# Altium schematic sheet Control_Sense_BOTT.SchDoc (part 1 of 5)
size A0 portrait; SheetNumber: 1; SheetTotal: 4
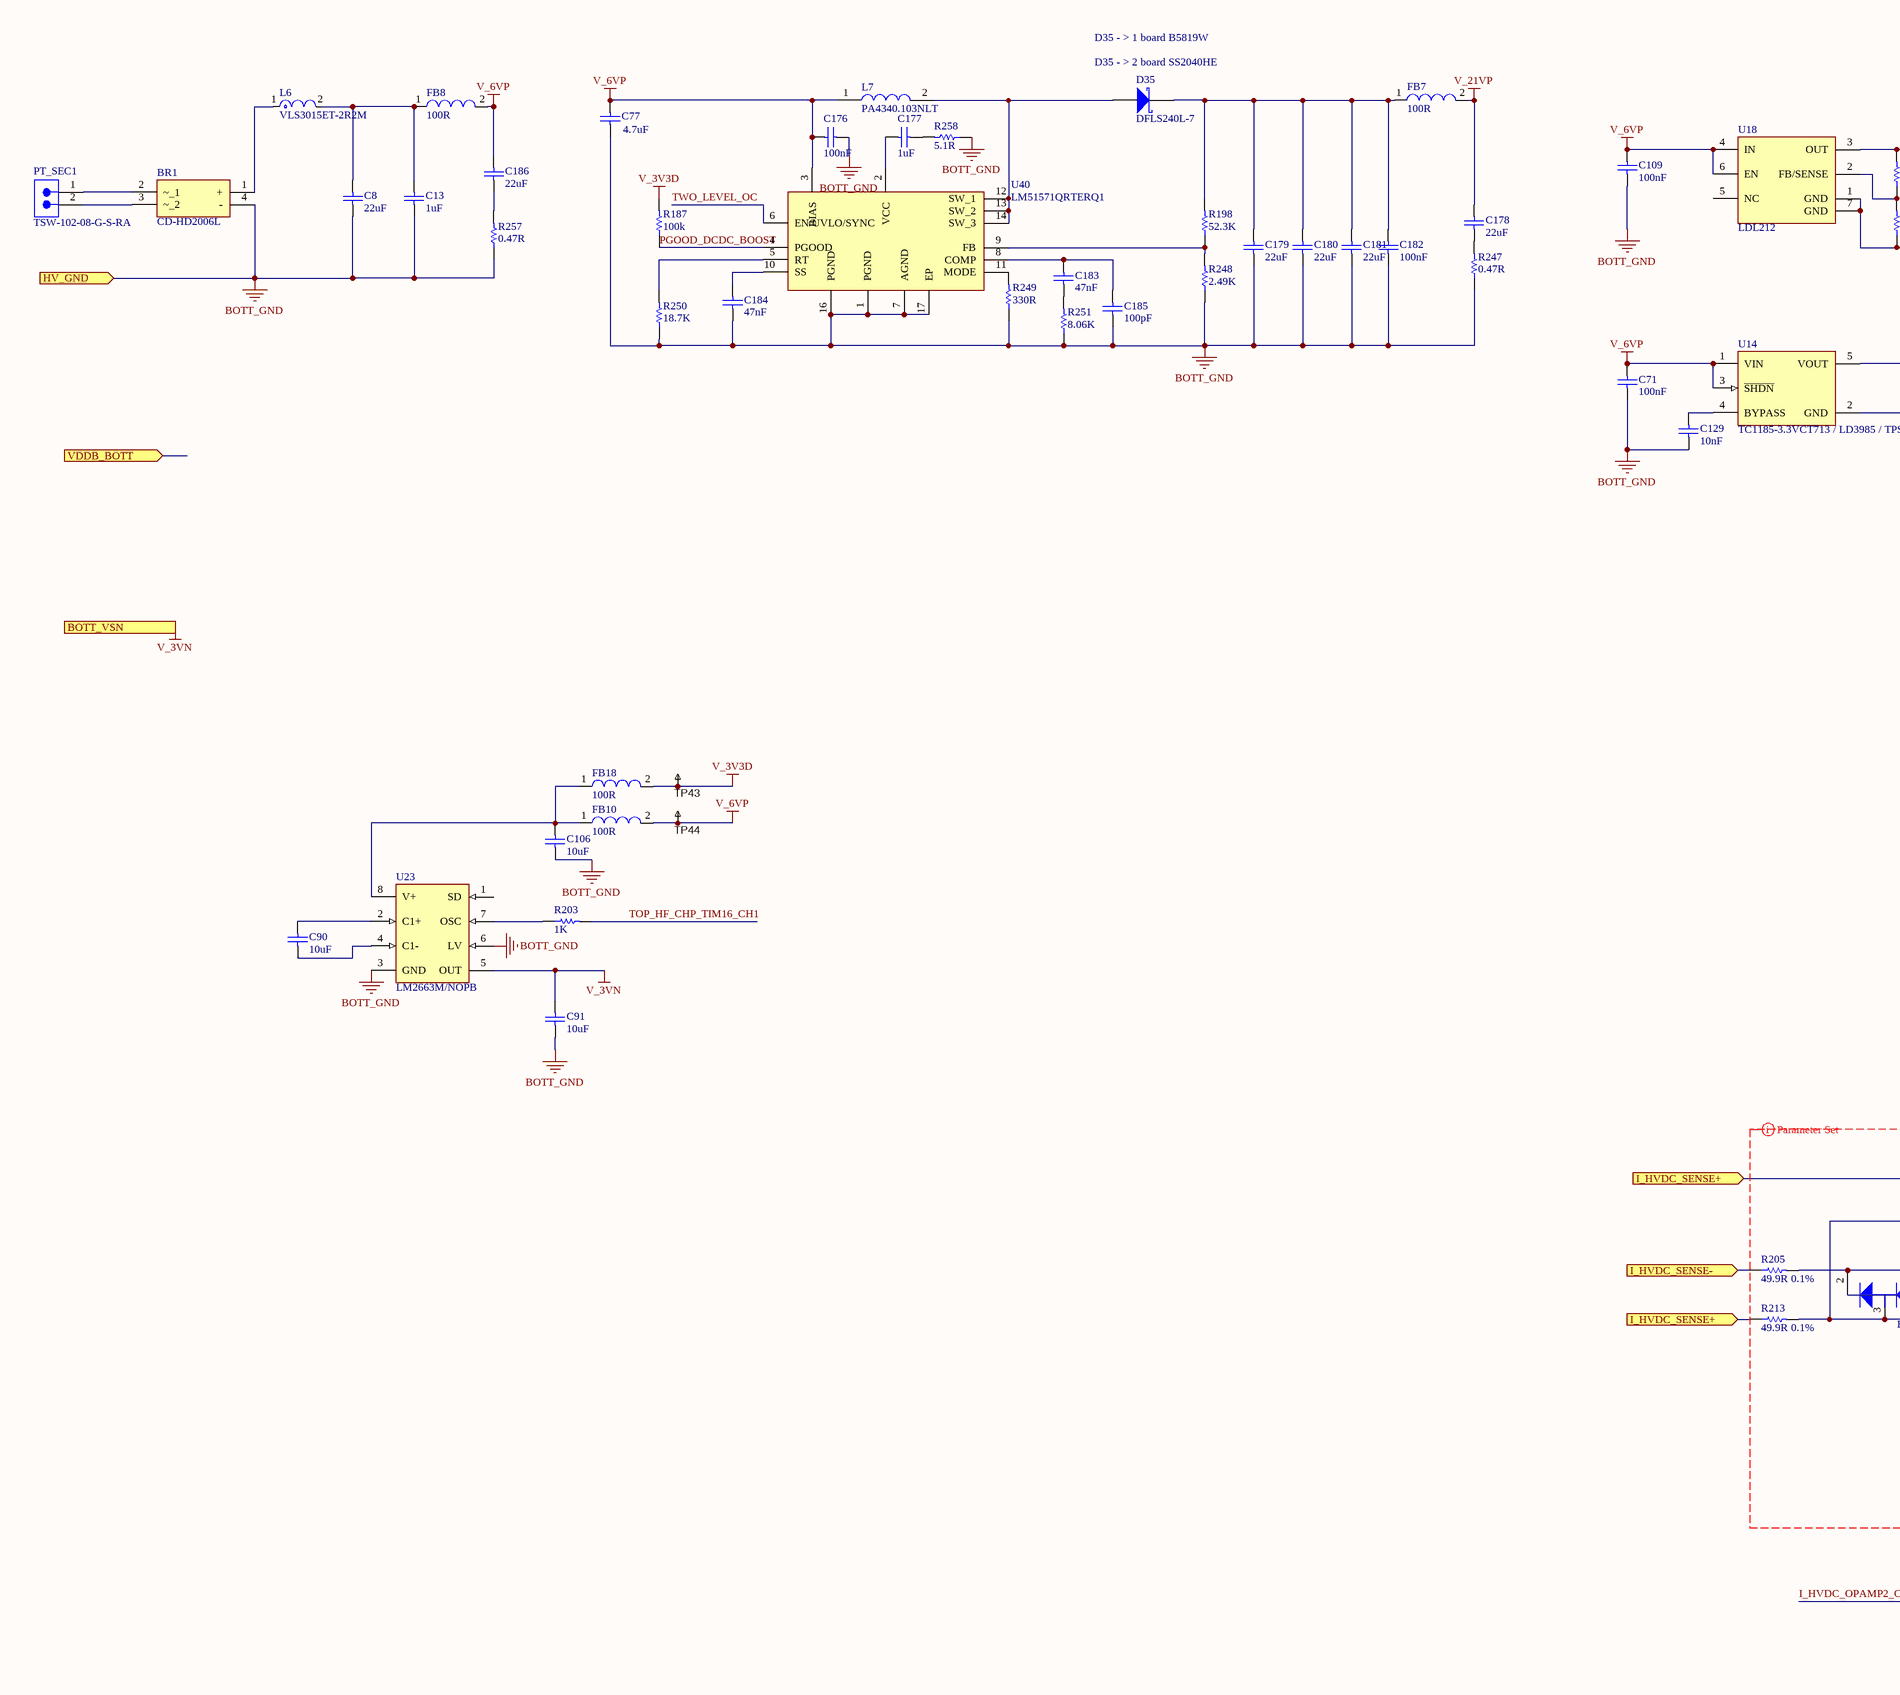
[diagram p0: Control_Sense_BOTT.SchDoc, top left]
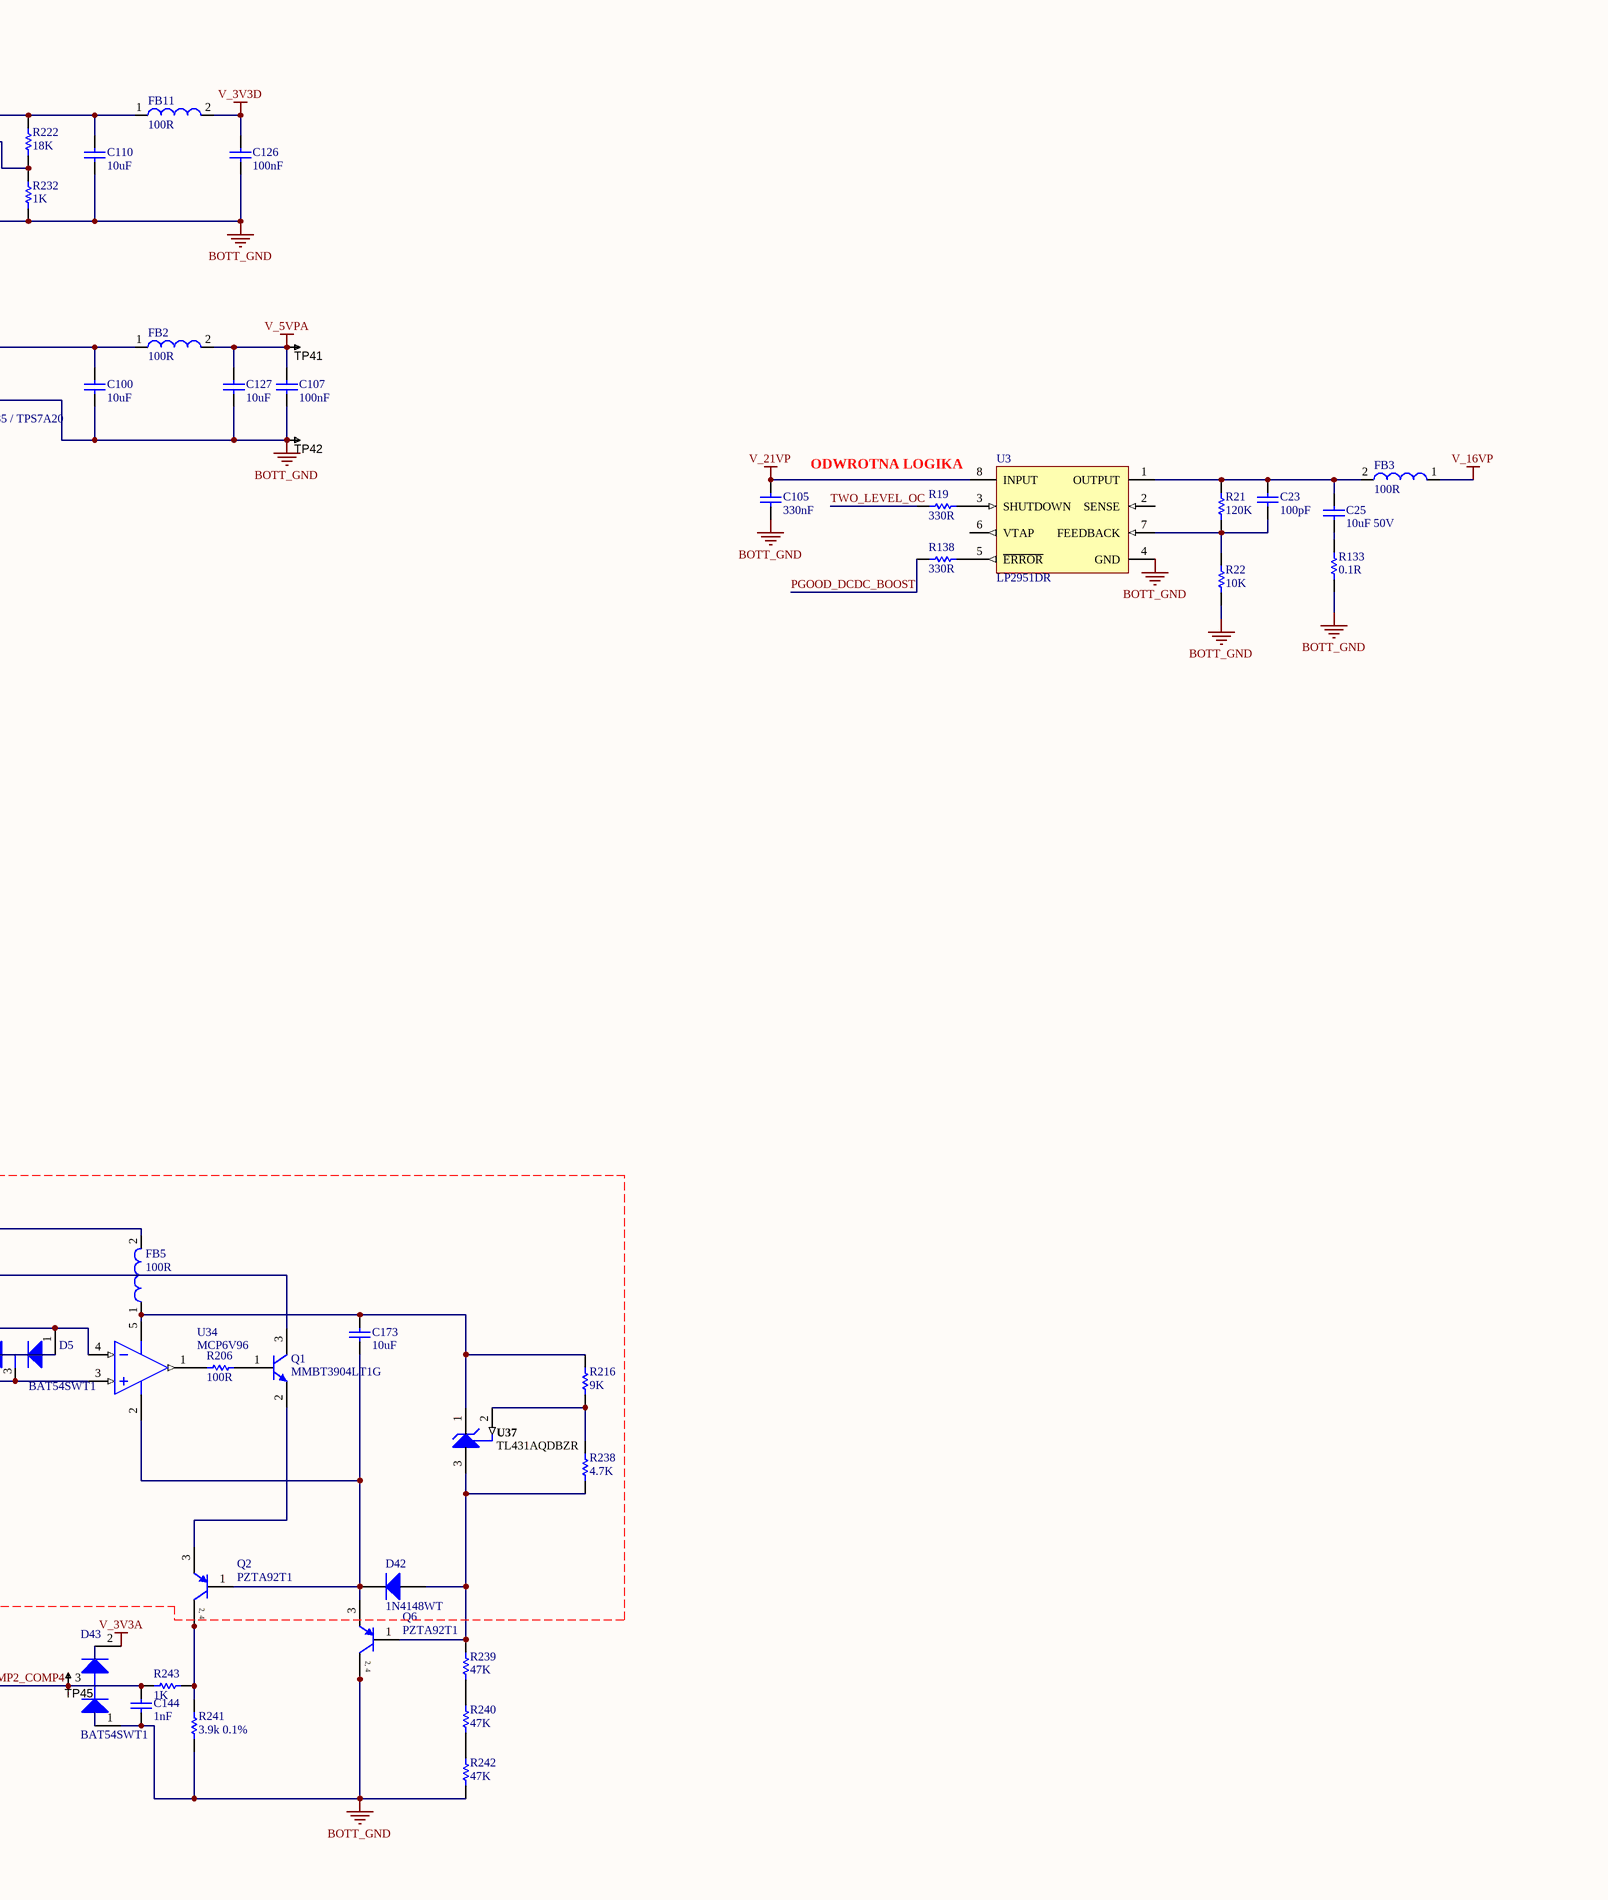
[diagram p1: Control_Sense_BOTT.SchDoc, top right]
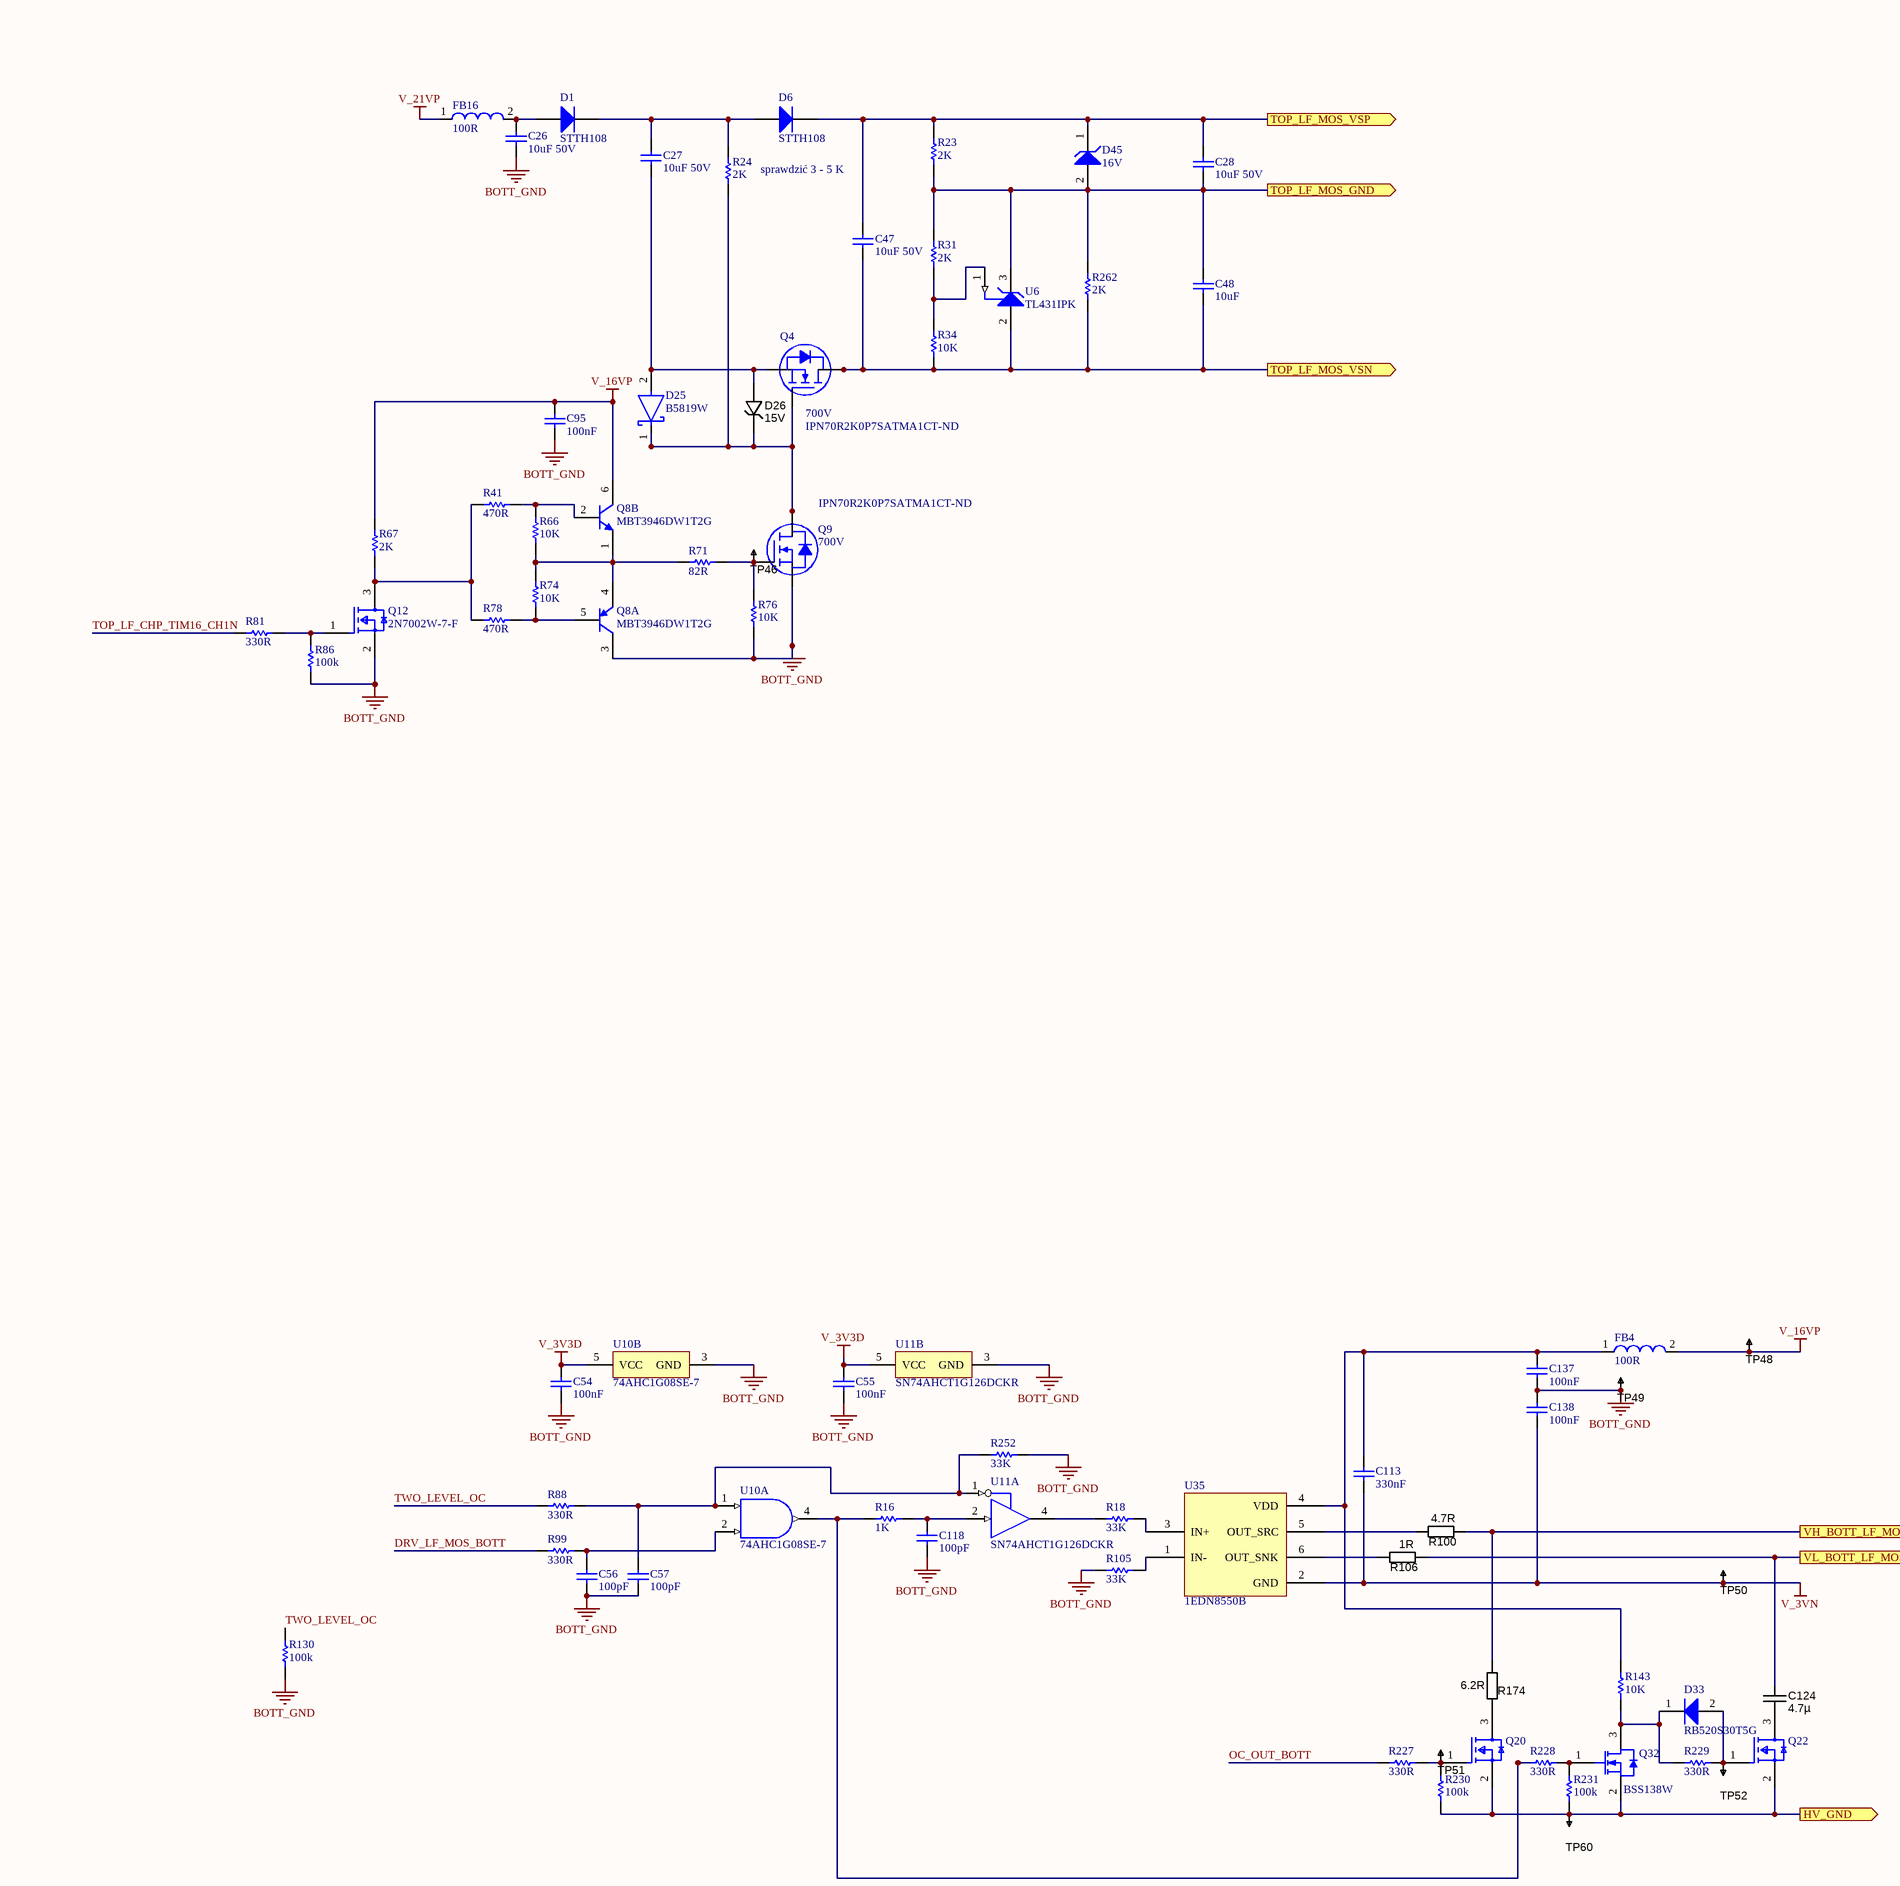
[diagram p2: Control_Sense_BOTT.SchDoc, centre left]
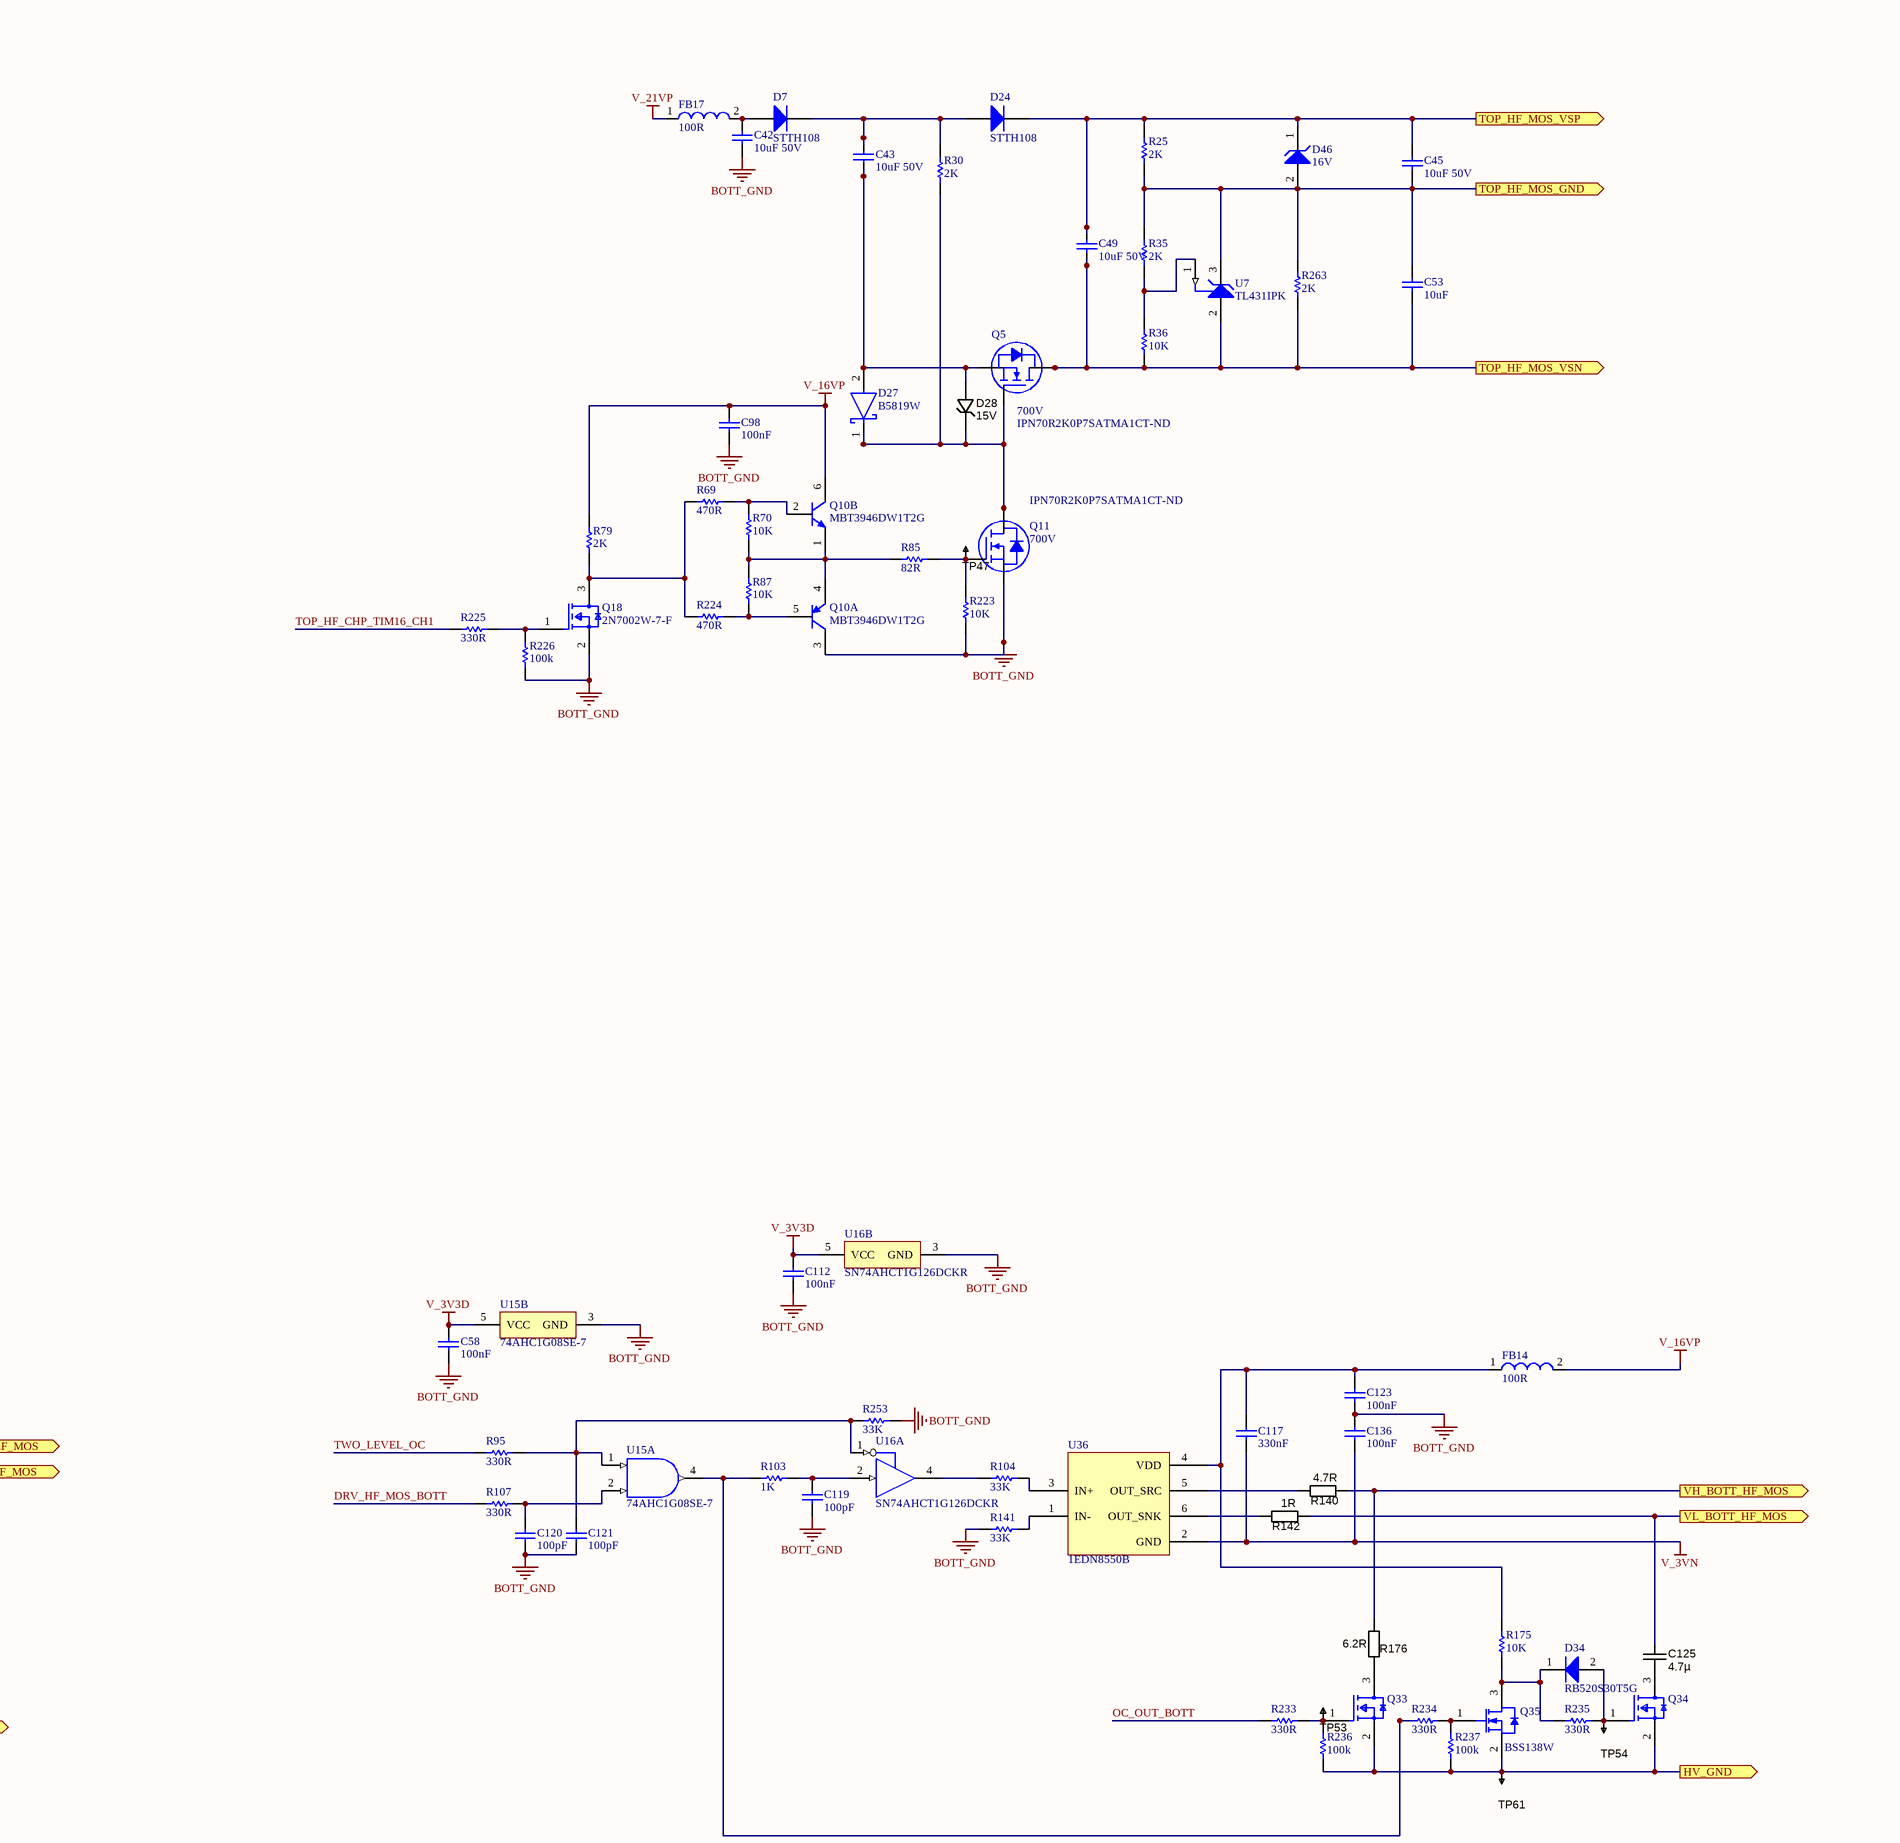
[diagram p3: Control_Sense_BOTT.SchDoc, centre right]
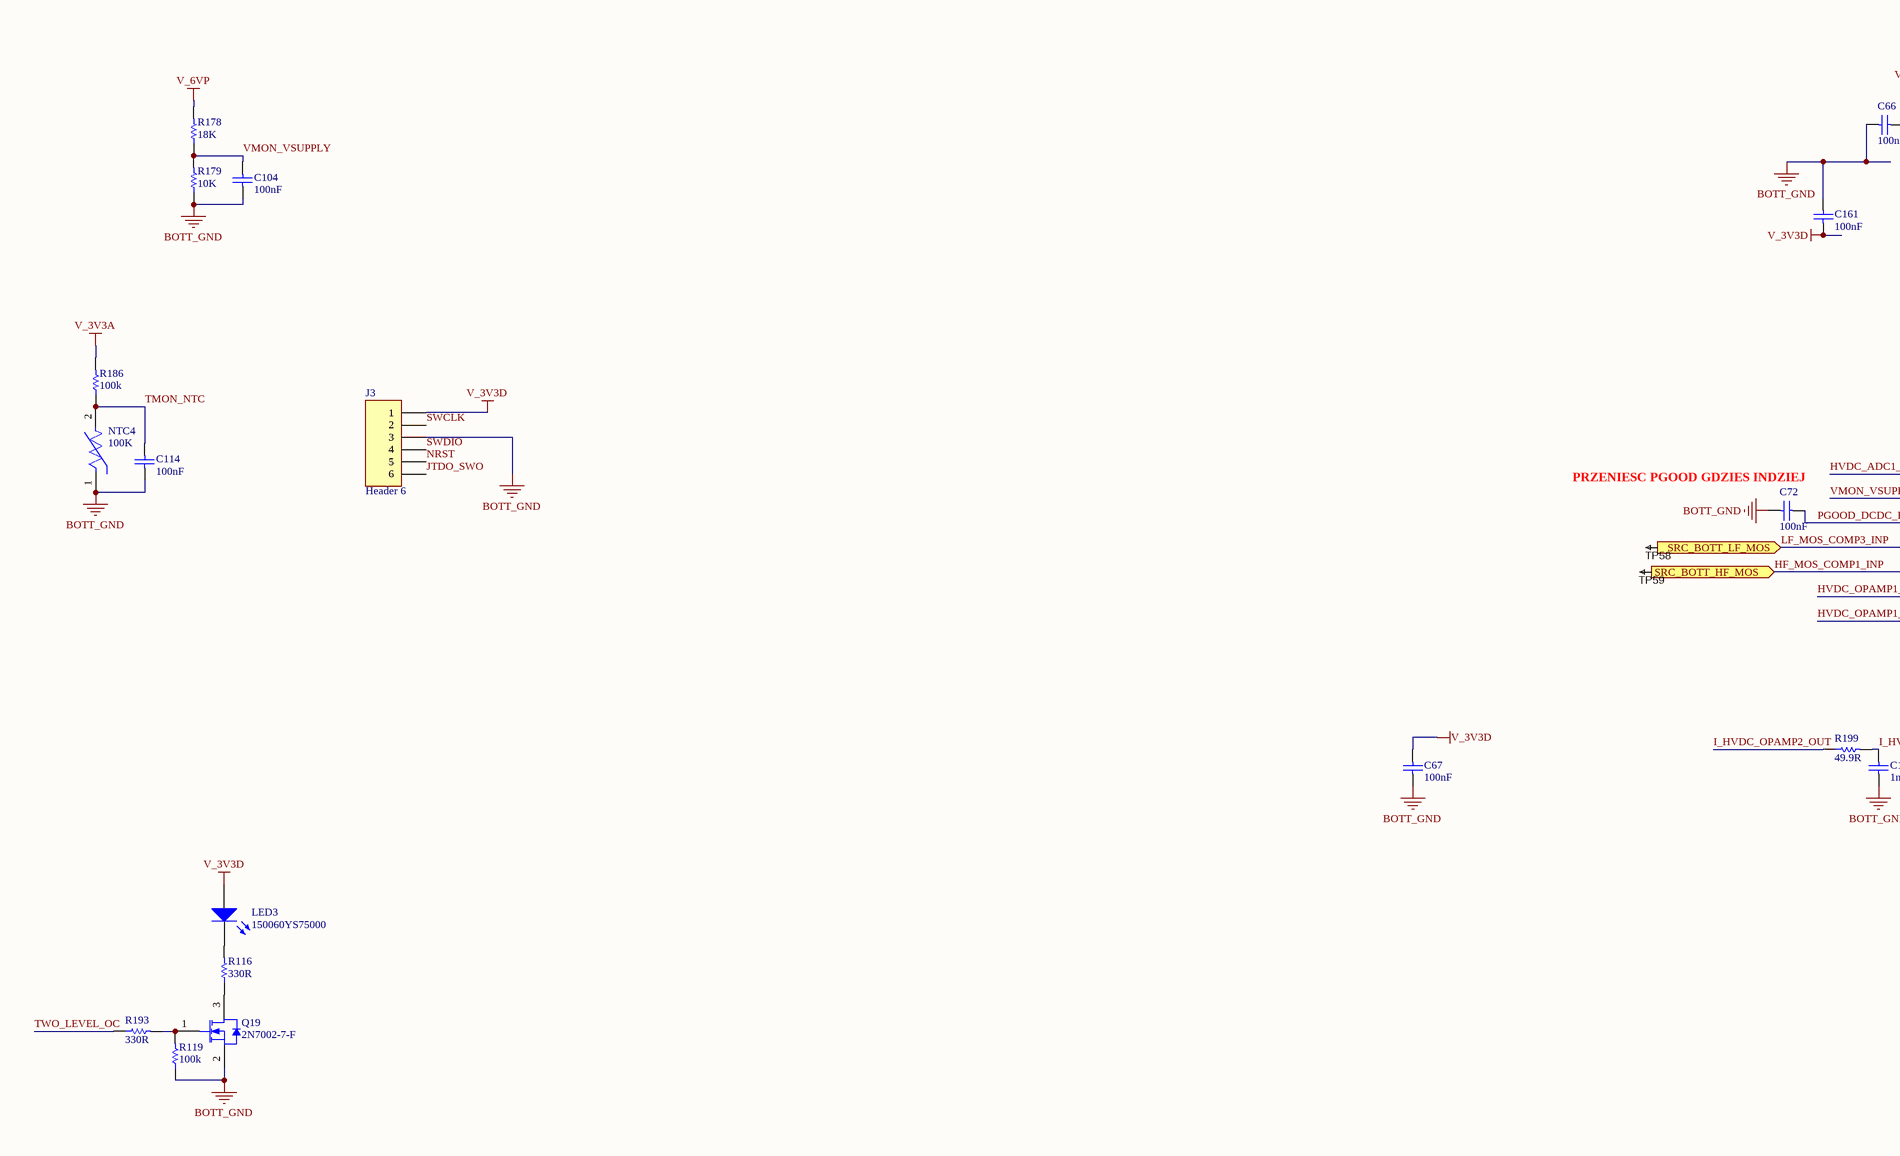
[diagram p4: Control_Sense_BOTT.SchDoc, bottom left]
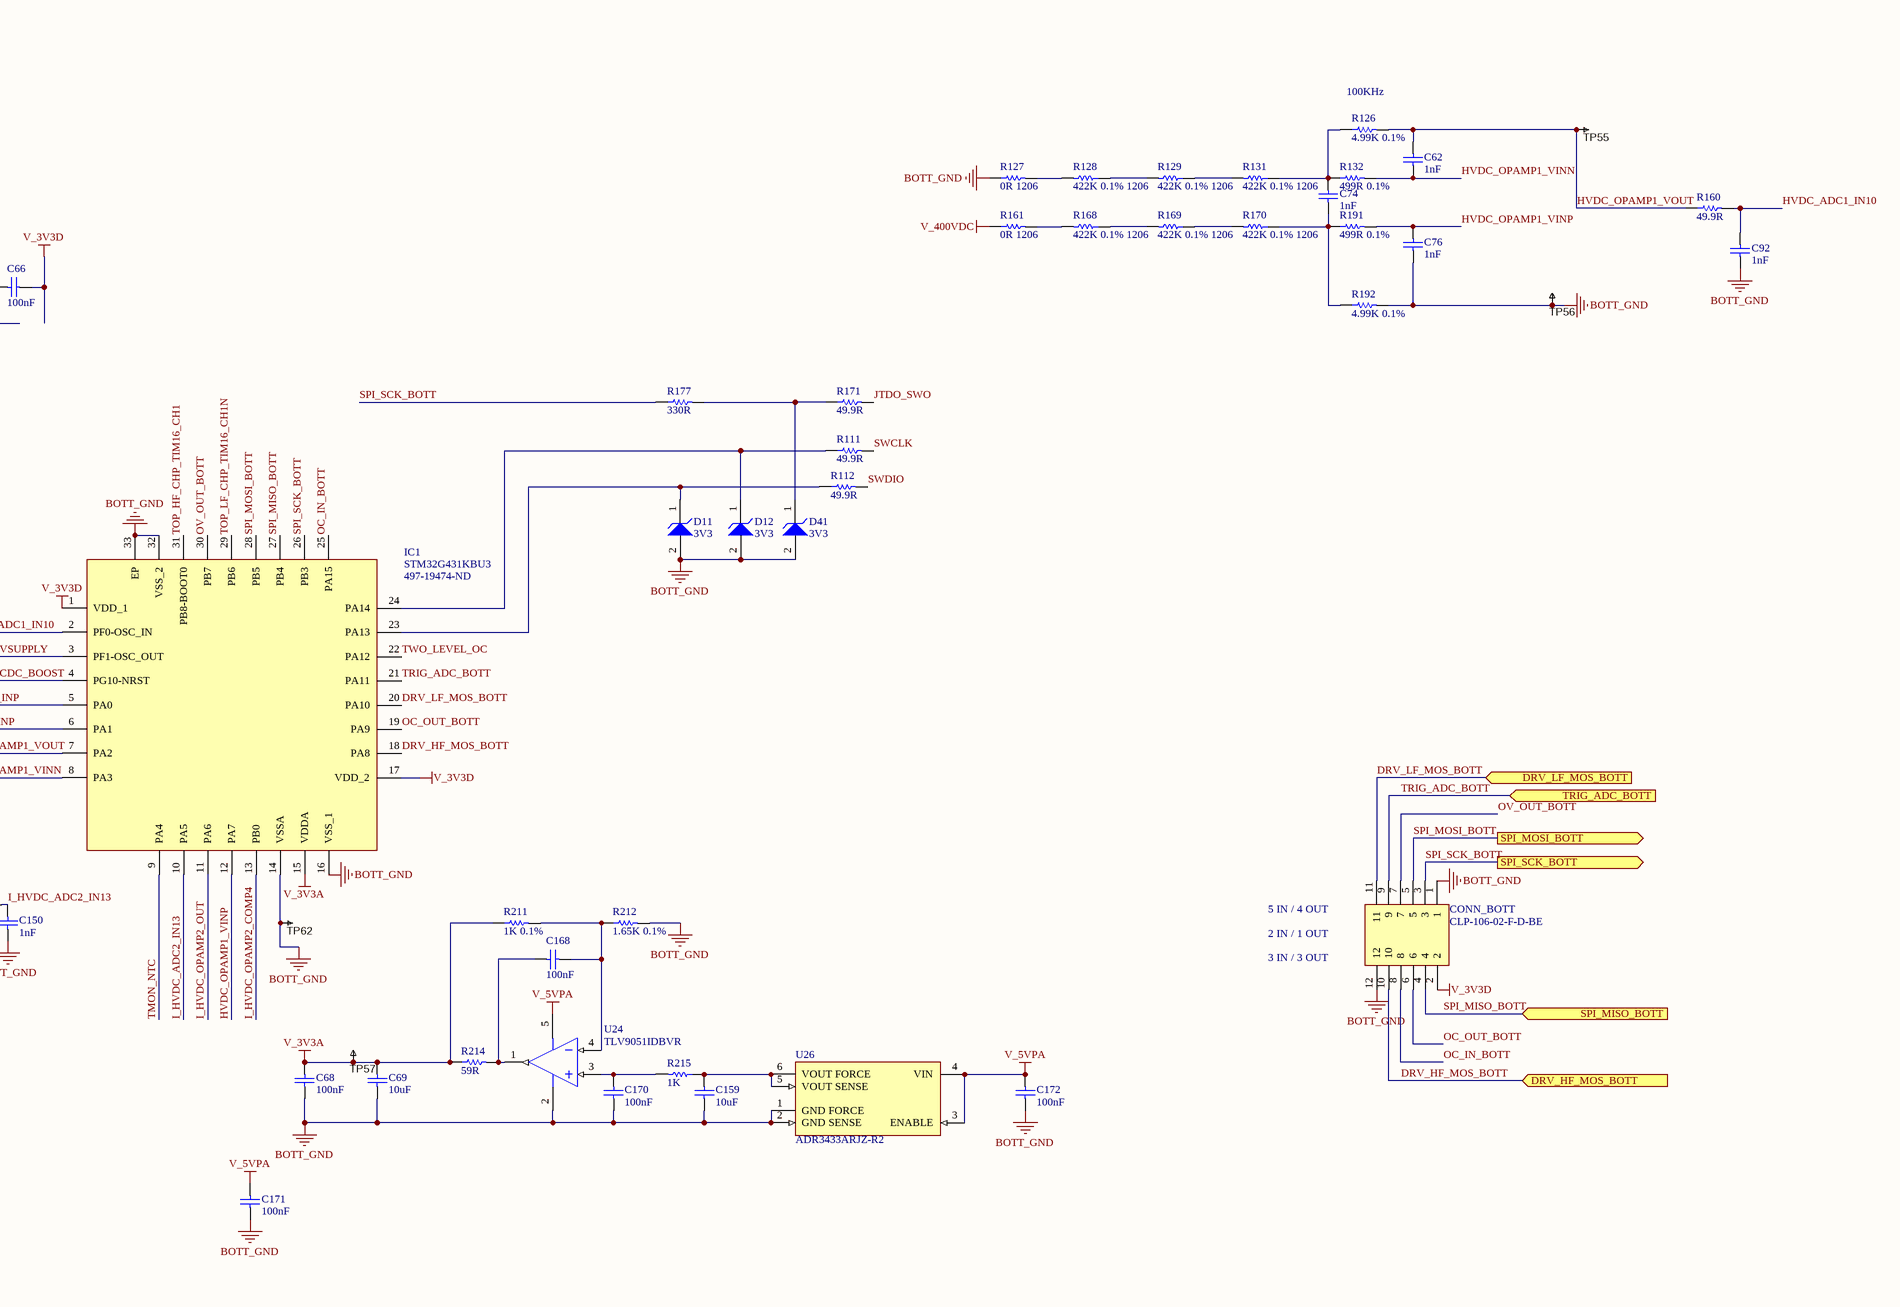
[diagram p5: Control_Sense_BOTT.SchDoc, bottom right]

## Parts
BR1  CD-HD2006L  [CDHD2006L]
C8  22uF  [CAPC1206(3216)190_N]
C13  1uF  [CAPC1608X86X35NL15T15]
C23  100pF  [CAPC1608X90X35NL10T15]
C25  10uF 50V  [CAPC3216X229X50NL20T25]
C26  10uF 50V  [CAPC3216X229X50NL20T25]
C27  10uF 50V  [CAPC3216X229X50NL20T25]
C28  10uF 50V  [CAPC3216X229X50NL20T25]
C42  10uF 50V  [CAPC3216X229X50NL20T25]
C43  10uF 50V  [CAPC3216X229X50NL20T25]
C45  10uF 50V  [CAPC3216X229X50NL20T25]
C47  10uF 50V  [CAPC3216X229X50NL20T25]
C48  10uF  [CAPC2013X140X45NL15T25]
C49  10uF 50V  [CAPC3216X229X50NL20T25]
C53  10uF  [CAPC2013X140X45NL15T25]
C54  100nF  [CAPC1608X90X35NL10T15]
C55  100nF  [CAPC1608X90X35NL10T15]
C56  100pF  [CAPC1608X90X35NL10T15]
C57  100pF  [CAPC1608X90X35NL10T15]
C58  100nF  [CAPC1608X90X35NL10T15]
C62  1nF  [CAPC1608X90X35NL15T15]
C66  100nF  [CAPC1608X90X35NL10T15]
C67  100nF  [CAPC1608X90X35NL10T15]
C68  100nF  [CAPC1005X56X25NL10T15]
C69  10uF  [CAPC2013X140X45NL15T25]
C71  100nF  [CAPC1608X90X35NL10T15]
C72  100nF  [CAPC1005X56X25NL10T15]
C74  1nF  [CAPC1608X90X35NL15T15]
C76  1nF  [CAPC1608X90X35NL15T15]
C77  Capacitance: 4.7uF  [CAPC3216X180X50NL20T25]  (hidden comment: C1206C105K3RACTU)
C90  10uF  [CAPC2013X140X45NL15T25]
C91  10uF  [CAPC2013X140X45NL15T25]
C92  1nF  [CAPC1005X56X25NL10T15]
C95  100nF  [CAPC1608X90X35NL10T15]
C98  100nF  [CAPC1608X90X35NL10T15]
C100  10uF  [CAPC2013X140X45NL15T25]
C104  100nF  [CAPC1005X56X25NL10T15]
C105  330nF  [CAPC2013X135X45NL10T25]
C106  10uF  [CAPC1608X90X40NL10T20]
C107  100nF  [CAPC1608X90X35NL10T15]
C109  100nF  [CAPC1608X90X35NL10T15]
C110  10uF  [CAPC1608X90X40NL10T20]
C112  100nF  [CAPC1608X90X35NL10T15]
C113  330nF  [CAPC2013X135X45NL10T25]
C114  100nF  [CAPC1005X56X25NL10T15]
C117  330nF  [CAPC2013X135X45NL10T25]
C118  100pF  [CAPC1005X55X25NL05T10]
C119  100pF  [CAPC1005X55X25NL05T10]
C120  100pF  [CAPC1608X90X35NL10T15]
C121  100pF  [CAPC1608X90X35NL10T15]
C123  100nF  [CAPC1608X90X35NL10T15]
C124  value 4.7µ  [CAPC2012X135N]  (hidden comment: 4.7uF)
C125  value 4.7µ  [CAPC2012X135N]  (hidden comment: 4.7uF)
C126  100nF  [CAPC1608X90X35NL10T15]
C127  10uF  [CAPC2013X140X45NL15T25]
C129  10nF  [CAPC1608X90X35NL10T15]
C136  100nF  [CAPC1608X90X35NL10T15]
C137  100nF  [CAPC1608X90X35NL10T15]
C138  100nF  [CAPC1608X90X35NL10T15]
C144  1nF  [CAPC1005X56X25NL10T15]
C150  1nF  [CAPC1005X56X25NL10T15]
C159  10uF  [CAPC1608X90X40NL10T20]
C161  100nF  [CAPC1608X90X35NL10T15]
C168  100nF  [CAPC1608X90X35NL10T15]
C170  100nF  [CAPC1608X90X35NL10T15]
C171  100nF  [CAPC1608X90X35NL10T15]
C172  100nF  [CAPC1608X90X35NL10T15]
C173  10uF  [CAPC2013X145X20NL20]
C176  100nF  [CAPC1608X90X35NL10T15]
C177  1uF  [CAPC1608X86X35NL15T15]
C178  22uF  [CAPC3225X279X50NL20T25]
C179  22uF  [CAPC3225X279X50NL20T25]
C180  22uF  [CAPC3225X279X50NL20T25]
C181  22uF  [CAPC3225X279X50NL20T25]
C182  100nF  [CAPC1608X90X35NL10T15]
C183  47nF  [CAPC1608X90X35NL10T15]
C184  47nF  [CAPC1608X90X35NL10T15]
C185  100pF  [CAPC1608X90X35NL10T15]
C186  22uF  [CAPC1206(3216)190_N]
CONN_BOTT  CLP-106-02-F-D-BE  [CLP-106-02-XXX-D-BE]
D1  STTH108  [DO-214AC]
D5  BAT54SWT1  [ONSC-SOT-323-3-419-04_V]
D6  STTH108  [DO-214AC]
D7  STTH108  [DO-214AC]
D11  3V3  [ONSC-SOD-523-2-502-01_V]
D12  3V3  [ONSC-SOD-523-2-502-01_V]
D24  STTH108  [DO-214AC]
D25  B5819W  [FP-PowerDI123-MFG]
D26  15V  [SOD323]
D27  B5819W  [FP-PowerDI123-MFG]
D28  15V  [SOD323]
D33  RB520S30T5G  [ONSC-SOD-523-2-502-01_V]
D34  RB520S30T5G  [ONSC-SOD-523-2-502-01_V]
D35  DFLS240L-7  [DIOD-POWERDI123-2_A_V]
D41  3V3  [ONSC-SOD-523-2-502-01_V]
D42  1N4148WT  [FAIR-SOD-523F-2_V]
D43  BAT54SWT1  [ONSC-SOT-323-3-419-04_V]
D45  16V  [ONSC-SOD-323-2-477-02_V]
D46  16V  [ONSC-SOD-323-2-477-02_V]
FB2  100R  [SMD-0603]
FB3  100R  [SMD-0603]
FB4  100R  [SMD-0603]
FB5  100R  [SMD-0603]
FB7  100R  [SMD-0603]
FB8  100R  [SMD-0603]
FB10  100R  [SMD-0603]
FB11  100R  [SMD-0603]
FB14  100R  [SMD-0603]
FB16  100R  [SMD-0603]
FB17  100R  [SMD-0603]
FB18  100R  [SMD-0603]
IC1  STM32G431KBU3  Supplier Part Number 1: 497-19474-ND  [QFN50P500X500X60-33N-D]
J3  Header 6  [HDR1X6]
L6  VLS3015ET-2R2M  [FP-VLS3015CX-H-MFG]
L7  PA4340.103NLT  [PA4340333NLT]
LED3  150060YS75000  [0603_A]
NTC4  100K  [FP-NXR_151B030-MFG]
PT_SEC1  TSW-102-08-G-S-RA  [SMTC-TSW-102-08-X-S-RA]
Q1  MMBT3904LT1G  [ONSC-SOT-23-3-318-08_V]
Q2  PZTA92T1  [SOT223]
Q4  700V  Supplier Part Number 1: IPN70R2K0P7SATMA1CT-ND  [SOT223-3]
Q5  700V  Supplier Part Number 1: IPN70R2K0P7SATMA1CT-ND  [SOT223-3]
Q6  PZTA92T1  [SOT223]
Q8  MBT3946DW1T2G  [ONSC-SC70-6-419B-02_W_V]  (parts A,B of 2)
Q9  700V  Supplier Part Number 1: IPN70R2K0P7SATMA1CT-ND  [SOT223-3]
Q10  MBT3946DW1T2G  [ONSC-SC70-6-419B-02_W_V]  (parts A,B of 2)
Q11  700V  Supplier Part Number 1: IPN70R2K0P7SATMA1CT-ND  [SOT223-3]
Q12  2N7002W-7-F  [FP-SOT323-IPC_B]
Q18  2N7002W-7-F  [FP-SOT323-IPC_B]
Q19  2N7002-7-F  [DIOD-SOT23-3_V]
Q20  DMN3067LW-7  [FP-SOT323-IPC_C]  (value not drawn)
Q22  DMN3067LW-7  [FP-SOT323-IPC_C]  (value not drawn)
Q32  BSS138W  [NXP-SOT323_M]
Q33  DMN3067LW-7  [FP-SOT323-IPC_C]  (value not drawn)
Q34  DMN3067LW-7  [FP-SOT323-IPC_C]  (value not drawn)
Q35  BSS138W  [NXP-SOT323_M]
R16  1K  [RESC1005X40X25NL05T10]
R18  33K  [RESC1005X40X25ML05T05]
R19  330R  [RESC1608X55X25NL10T15]
R21  120K  [RESC1608X55X30NL15T15]
R22  10K  [RESC1609X50X30NL10T20]
R23  2K  [RESC3116X65X50ML20T20]
R24  2K  [RESC3116X65X50ML20T20]
R25  2K  [RESC3116X65X50ML20T20]
R30  2K  [RESC3116X65X50ML20T20]
R31  2K  [RESC1609X55X30NL15T15]
R34  10K  [RESC1609X55X30NL15T15]
R35  2K  [RESC1609X55X30NL15T15]
R36  10K  [RESC1609X55X30NL15T15]
R41  470R  [RESC1608X55X30NL15T15]
R66  10K  [RESC1609X55X30NL15T15]
R67  2K  [RESC1609X55X30NL15T15]
R69  470R  [RESC1608X55X30NL15T15]
R70  10K  [RESC1609X55X30NL15T15]
R71  82R  [RESC1608X55X30NL15T15]
R74  10K  [RESC1609X55X30NL15T15]
R76  10K  [RESC1609X55X30NL15T15]
R78  470R  [RESC1608X55X30NL15T15]
R79  2K  [RESC1609X55X30NL15T15]
R81  330R  [RESC1608X55X25NL10T15]
R85  82R  [RESC1608X55X30NL15T15]
R86  100k  [RESC1608X55X30NL15T15]
R87  10K  [RESC1609X55X30NL15T15]
R88  330R  [RESC1608X55X25NL10T15]
R95  330R  [RESC1608X55X25NL10T15]
R99  330R  [RESC1608X55X25NL10T15]
R100  4.7R  [RESC2012X70N]
R103  1K  [RESC1005X40X25NL05T10]
R104  33K  [RESC1005X40X25ML05T05]
R105  33K  [RESC1005X40X25ML05T05]
R106  1R  [RESC2012X70N]
R107  330R  [RESC1608X55X25NL10T15]
R111  49.9R  [RESC1608X55X30NL15T15]
R112  49.9R  [RESC1608X55X30NL15T15]
R116  330R  [RESC1608X55X25NL10T15]
R119  100k  [RESC1608X55X30NL15T15]
R126  4.99K 0.1%  [RESC1608X55X30NL20T20]
R127  0R 1206  [RESC3216X70X50NL05T20]
R128  422K 0.1% 1206  [RESC1206(3216)_N]
R129  422K 0.1% 1206  [RESC1206(3216)_N]
R130  100k  [RESC1608X55X30NL15T15]
R131  422K 0.1% 1206  [RESC1206(3216)_N]
R132  499R 0.1%  [RESC1608X55X30LL20T20]
R133  0.1R  [RESC1608X55X25ML10T15]
R138  330R  [RESC1608X55X25NL10T15]
R140  4.7R  [RESC2012X70N]
R141  33K  [RESC1005X40X25ML05T05]
R142  1R  [RESC2012X70N]
R143  10K  [RESC1609X55X30NL15T15]
R160  49.9R  [RESC1005X40X25NL05T05]
R161  0R 1206  [RESC3216X70X50NL05T20]
R168  422K 0.1% 1206  [RESC1206(3216)_N]
R169  422K 0.1% 1206  [RESC1206(3216)_N]
R170  422K 0.1% 1206  [RESC1206(3216)_N]
R171  49.9R  [RESC1608X55X30NL15T15]
R174  6.2R  [RESC2012X70N]
R175  10K  [RESC1609X55X30NL15T15]
R176  6.2R  [RESC2012X70N]
R177  330R  [RESC1608X55X25NL10T15]
R178  18K  [RESC1608X55X30NL20T20]
R179  10K  [RESC1609X50X30NL10T20]
R186  100k  [RESC1608X55X30NL15T15]
R187  100k  [RESC1608X55X30NL15T15]
R191  499R 0.1%  [RESC1608X55X30LL20T20]
R192  4.99K 0.1%  [RESC1608X55X30NL20T20]
R193  330R  [RESC1608X55X25NL10T15]
R198  52.3K  [RESC1608X55X25LL10T15]
R199  49.9R  [RESC1005X40X25NL05T05]
R203  1K  [RESC1005X40X25NL05T10]
R205  49.9R 0.1%  [RESC1608X55X25ML10T15]
R206  100R  [RESC1608X55X25NL10T15]
R211  1K 0.1%  [RESC1608X55X30LL20T20]
R212  1.65K 0.1%  [RESC1608X55X30LL20T20]
R213  49.9R 0.1%  [RESC1608X55X25ML10T15]
R214  59R  [RESC1608X55X30NL15T15]
R215  1K  [RESC1608X55X30NL15T15]
R216  9K  [RESC1608X55X30NL20T10]
R222  18K  [RESC1608X55X30NL20T20]
R223  10K  [RESC1609X55X30NL15T15]
R224  470R  [RESC1608X55X30NL15T15]
R225  330R  [RESC1608X55X25NL10T15]
R226  100k  [RESC1608X55X30NL15T15]
R227  330R  [RESC1608X55X25NL10T15]
R228  330R  [RESC1608X55X25NL10T15]
R229  330R  [RESC1608X55X25NL10T15]
R230  100k  [RESC1608X55X30NL15T15]
R231  100k  [RESC1608X55X30NL15T15]
R232  1K  [RESC1608X55X30NL15T15]
R233  330R  [RESC1608X55X25NL10T15]
R234  330R  [RESC1608X55X25NL10T15]
R235  330R  [RESC1608X55X25NL10T15]
R236  100k  [RESC1608X55X30NL15T15]
R237  100k  [RESC1608X55X30NL15T15]
R238  4.7K  [RESC1608X55X30NL15T15]
R239  47K  [RESC1206(3216)_N]
R240  47K  [RESC1206(3216)_N]
R241  3.9k 0.1%  [RESC1608X55X30ML20T20]
R242  47K  [RESC1206(3216)_N]
R243  1K  [RESC1608X55X30NL15T15]
R247  0.47R  [RESC1608X55X25NL10T15]
R248  2.49K  [RESC1608X55X30LL15T15]
R249  330R  [RESC1608X55X25NL10T15]
R250  18.7K  [RESC1608X55X30LL15T15]
R251  8.06K  [RESC1609X50X30ML10T20]
R252  33K  [RESC1005X40X25ML05T05]
R253  33K  [RESC1005X40X25ML05T05]
R257  0.47R  [RESC1608X55X25NL10T15]
R258  5.1R  [RESC1608X55X30NL15T15]
R262  2K  [RESC2013X70X40LL20T20]
R263  2K  [RESC2013X70X40LL20T20]
TP41  TESTPOINT  [TP-R60]  (value not drawn)  (no BOM)
TP42  TESTPOINT  [TP-R60]  (value not drawn)  (no BOM)
TP43  TESTPOINT  [TP-R60]  (value not drawn)  (no BOM)
TP44  TESTPOINT  [TP-R60]  (value not drawn)  (no BOM)
TP45  TESTPOINT  [TP-R60]  (value not drawn)  (no BOM)
TP46  TESTPOINT  [TP-R60]  (value not drawn)  (no BOM)
TP47  TESTPOINT  [TP-R60]  (value not drawn)  (no BOM)
TP48  TESTPOINT  [TP-R60]  (value not drawn)  (no BOM)
TP49  TESTPOINT  [TP-R60]  (value not drawn)  (no BOM)
TP50  TESTPOINT  [TP-R60]  (value not drawn)  (no BOM)
TP51  TESTPOINT  [TP-R60]  (value not drawn)  (no BOM)
TP52  TESTPOINT  [TP-R60]  (value not drawn)  (no BOM)
TP53  TESTPOINT  [TP-R60]  (value not drawn)  (no BOM)
TP54  TESTPOINT  [TP-R60]  (value not drawn)  (no BOM)
TP55  TESTPOINT  [TP-R60]  (value not drawn)  (no BOM)
TP56  TESTPOINT  [TP-R60]  (value not drawn)  (no BOM)
TP57  TESTPOINT  [TP-R60]  (value not drawn)  (no BOM)
TP58  TESTPOINT  [TP-R60]  (value not drawn)  (no BOM)
TP59  TESTPOINT  [TP-R60]  (value not drawn)  (no BOM)
TP60  TESTPOINT  [TP-R60]  (value not drawn)  (no BOM)
TP61  TESTPOINT  [TP-R60]  (value not drawn)  (no BOM)
TP62  TESTPOINT  [TP-R60]  (value not drawn)  (no BOM)
U3  LP2951DR  [SOIC127P600X175-8AN]
U6  TL431IPK  [PK0003A_N]
U7  TL431IPK  [PK0003A_N]
U10  74AHC1G08SE-7  [DCK0005A_M]  (parts A,B of 2)
U11  SN74AHCT1G126DCKR  [DCK0005A_L]  (parts A,B of 2)
U14  TC1185-3.3VCT713 / LD3985 / TPS7A20  [SOT23-5]
U15  74AHC1G08SE-7  [DCK0005A_M]  (parts A,B of 2)
U16  SN74AHCT1G126DCKR  [DCK0005A_L]  (parts A,B of 2)
U18  LDL212  [LDL212PUR]
U23  LM2663M/NOPB  [SOIC127P600X175-8AN]
U24  TLV9051IDBVR  [SOT23-5]
U26  ADR3433ARJZ-R2  [SOT23-6]
U34  MCP6V96  [SOT23-5]
U35  1EDN8550B  [SOT23-6]
U36  1EDN8550B  [SOT23-6]
U37  TL431AQDBZR  [DBZ0003A_M]
U40  LM51571QRTERQ1  [QFN50P300X300X80-17N-D]

## Ports
BOTT_VSN (out), DRV_HF_MOS_BOTT (in), DRV_LF_MOS_BOTT (in), HV_GND (in), HV_GND (out), I_HVDC_SENSE+ (in), I_HVDC_SENSE- (in), SPI_MISO_BOTT (in), SPI_MOSI_BOTT (out), SPI_SCK_BOTT (out), SRC_BOTT_HF_MOS (in), SRC_BOTT_LF_MOS (in), TOP_HF_MOS_GND (out), TOP_HF_MOS_VSN (out), TOP_HF_MOS_VSP (out), TOP_LF_MOS_GND (out), TOP_LF_MOS_VSN (out), TOP_LF_MOS_VSP (out), TRIG_ADC_BOTT (in), VDDB_BOTT (in), VH_BOTT_HF_MOS (out), VH_BOTT_LF_MOS (out), VL_BOTT_HF_MOS (out), VL_BOTT_LF_MOS (out)

## Nets
BOTT_GND: BR1.4(-) C8.1 C13.1 C26.1 C42.1 C54.1 C55.1 C56.1 C57.1 C58.1 C66.2 C67.1 C68.1 C69.1 C71.1 C72.2 C76.2 C77.1 C91.1 C92.1 C95.1 C98.1 C100.1 C104.1 C105.1 C106.1 C107.1 C109.1 C110.1 C112.1 C114.1 C118.1 C119.1 C120.1 C121.1 C123.1 C126.1 C127.1 C129.1 C136.2 C137.1 C138.2 C144.1 C150.1 C159.1 C161.2 C170.1 C171.1 C172.1 C176.1 C179.1 C180.1 C181.1 C182.1 C184.1 C185.1 CONN_BOTT.1 CONN_BOTT.12 D11.2(A) D12.2(A) D41.2(A) D43.1(A) IC1.14(VSSA) IC1.16(VSS_1) IC1.32(VSS_2) IC1.33(EP) J3.3 NTC4.1 Q6.2(C) Q6.4(C) Q8.3(C) Q9.3(S) Q10.3(C) Q11.3(S) Q12.2(S) Q18.2(S) Q19.2(S) Q20.2(S) Q22.2(S) Q32.2(S) Q33.2(S) Q34.2(S) Q35.2(S) R22.1 R76.2 R86.1 R105.1 R119.1 R127.1 R130.1 R133.1 R141.1 R179.1 R192.2 R212.2 R223.2 R226.1 R230.1 R231.1 R232.1 R236.1 R237.1 R241.1 R242.2 R247.1 R248.1 R249.1 R250.1 R251.1 R252.2 R253.2 R257.1 R258.1 TP42.1 TP49.1 TP56.1 TP60.1 TP61.1 TP62.1 U3.4(GND) U10.3(GND) U11.3(GND) U14.2(GND) U15.3(GND) U16.3(GND) U18.1(GND) U18.7(GND) U23.3(GND) U23.6(LV) U24.2(VSS) U26.1(GND_FORCE) U26.2(GND_SENSE) U40.1(PGND) U40.7(AGND) U40.16(PGND) U40.17(EP) ; port HV_GND
V_3V3A: C68.2 C69.2 D43.2(K) IC1.15(VDDA) R186.2 R211.1 R214.1 TP57.1
V_3V3D: C54.2 C55.2 C58.2 C66.1 C67.2 C112.2 C126.2 C161.1 CONN_BOTT.2 FB11.2 FB18.2 IC1.1(VDD_1) IC1.17(VDD_2) J3.1 LED3.2(A) R187.2 TP43.1 U10.5(VCC) U11.5(VCC) U15.5(VCC) U16.5(VCC)
V_3VN: C91.2 C113.1 C117.1 C136.1 C138.1 TP50.1 U23.5(OUT) U35.2(GND) U36.2(GND) ; port BOTT_VSN
V_5VPA: C107.2 C127.2 C171.2 C172.2 FB2.2 TP41.1 U24.5(VDD) U26.3(ENABLE) U26.4(VIN)
V_6VP: C71.2 C77.2 C109.2 C176.2 C186.2 FB8.2 FB10.2 L7.1 R178.2 TP44.1 U14.1(VIN) U14.3(~{SHDN}) U18.4(IN) U18.6(EN) U40.3(BIAS)
V_16VP: C95.2 C98.2 FB3.1 FB4.2 FB14.2 Q8.6(C) Q10.6(C) R67.1 R79.1 TP48.1
V_21VP: C105.2 C178.2 FB7.2 FB16.1 FB17.1 U3.8(INPUT)
V_400VDC: R161.1
DRV_HF_MOS_BOTT: CONN_BOTT.10 IC1.18(PA8) R107.1 ; port DRV_HF_MOS_BOTT
DRV_LF_MOS_BOTT: CONN_BOTT.11 IC1.20(PA10) R99.1 ; port DRV_LF_MOS_BOTT
HF_MOS_COMP1_INP: IC1.6(PA1) TP59.1 ; port SRC_BOTT_HF_MOS
HVDC_ADC1_IN10: C92.2 IC1.2(PF0-OSC_IN) R160.2
HVDC_OPAMP1_VINN: C62.1 IC1.8(PA3) R132.2
HVDC_OPAMP1_VINP: C76.1 IC1.12(PA7) R191.2
HVDC_OPAMP1_VOUT: C62.2 IC1.7(PA2) R126.2 R160.1 TP55.1
I_HVDC_ADC2_IN13: C150.2 IC1.10(PA5) R199.2
I_HVDC_OPAMP2_COMP4: C144.2 D43.3(K/A) IC1.13(PB0) R243.2 TP45.1
I_HVDC_OPAMP2_OUT: IC1.11(PA6) R199.1
I_HVDC_SENSE+: FB5.2 R213.1 ; port I_HVDC_SENSE+
I_HVDC_SENSE-: R205.1 ; port I_HVDC_SENSE-
JTDO_SWO: J3.6 R171.2
LF_MOS_COMP3_INP: IC1.5(PA0) TP58.1 ; port SRC_BOTT_LF_MOS
NRST: J3.5
OC_IN_BOTT: CONN_BOTT.8 IC1.25(PA15)
OC_OUT_BOTT: CONN_BOTT.6 IC1.19(PA9) R227.1 R233.1
OV_OUT_BOTT: CONN_BOTT.7 IC1.30(PB7)
PGOOD_DCDC_BOOST: C72.1 IC1.4(PG10-NRST) R138.1 R187.1 U40.4(PGOOD)
SPI_MISO_BOTT: CONN_BOTT.4 IC1.27(PB4) ; port SPI_MISO_BOTT
SPI_MOSI_BOTT: CONN_BOTT.5 IC1.28(PB5) ; port SPI_MOSI_BOTT
SPI_SCK_BOTT: CONN_BOTT.3 IC1.26(PB3) R177.1 ; port SPI_SCK_BOTT
SWCLK: J3.2 R111.2
SWDIO: J3.4 R112.2
TMON_NTC: C114.2 IC1.9(PA4) NTC4.2 R186.1
TOP_HF_CHP_TIM16_CH1: IC1.31(PB8-BOOT0) R203.2 R225.1
TOP_HF_MOS_GND: C45.1 C53.2 D46.2(A) R25.1 R35.1 R263.2 U7.3(CATHODE) ; port TOP_HF_MOS_GND
TOP_HF_MOS_VSN: C49.1 C53.1 Q5.2(D) Q5.4(D) R36.2 R263.1 U7.2(ANODE) ; port TOP_HF_MOS_VSN
TOP_HF_MOS_VSP: C45.2 C49.2 D24.K D46.1(K) R25.2 ; port TOP_HF_MOS_VSP
TOP_LF_CHP_TIM16_CH1N: IC1.29(PB6) R81.1
TOP_LF_MOS_GND: C28.1 C48.2 D45.2(A) R23.1 R31.1 R262.2 U6.3(CATHODE) ; port TOP_LF_MOS_GND
TOP_LF_MOS_VSN: C47.1 C48.1 Q4.2(D) Q4.4(D) R34.2 R262.1 U6.2(ANODE) ; port TOP_LF_MOS_VSN
TOP_LF_MOS_VSP: C28.2 C47.2 D6.K D45.1(K) R23.2 ; port TOP_LF_MOS_VSP
TRIG_ADC_BOTT: CONN_BOTT.9 IC1.21(PA11) ; port TRIG_ADC_BOTT
TWO_LEVEL_OC: IC1.22(PA12) R19.1 R88.1 R95.1 R130.2 R193.1 U40.6(EN/UVLO/SYNC)
VH_BOTT_HF_MOS: R140.2 R176.2 ; port VH_BOTT_HF_MOS
VH_BOTT_LF_MOS: R100.2 R174.2 ; port VH_BOTT_LF_MOS
VL_BOTT_HF_MOS: C125.1 R142.2 ; port VL_BOTT_HF_MOS
VL_BOTT_LF_MOS: C124.1 R106.2 ; port VL_BOTT_LF_MOS
VMON_VSUPPLY: C104.2 IC1.3(PF1-OSC_OUT) R178.1 R179.2
NetBR1_1: BR1.1(+) L6.1
NetBR1_2: BR1.2(~_1) PT_SEC1.1
NetBR1_3: BR1.3(~_2) PT_SEC1.2
NetC8_2: C8.2 C13.2 FB8.1 L6.2
NetC23_1: C23.1 R21.1 R22.2 U3.7(FEEDBACK)
NetC23_2: C23.2 C25.2 FB3.2 R21.2 U3.1(OUTPUT)
NetC25_1: C25.1 R133.2
NetC26_2: C26.2 D1.A FB16.2
NetC27_1: C27.1 D25.2(A) D26.A Q4.3(S)
NetC27_2: C27.2 D1.K D6.A R24.2
NetC42_2: C42.2 D7.A FB17.2
NetC43_1: C43.1 D27.2(A) D28.A Q5.3(S)
NetC43_2: C43.2 D7.K D24.A R30.2
NetC56_2: C56.2 R99.2 U10.2(B)
NetC57_2: C57.2 R88.2 R252.1 U10.1(A) U11.1(OE)
NetC74_1: C74.1 R170.1 R191.1 R192.1
NetC74_2: C74.2 R126.1 R131.1 R132.1
NetC90_1: C90.1 U23.4(C1-)
NetC90_2: C90.2 U23.2(C1+)
NetC100_2: C100.2 FB2.1 U14.5(VOUT)
NetC106_2: C106.2 FB10.1 FB18.1 U23.8(V+)
NetC110_2: C110.2 FB11.1 R222.2 U18.3(OUT)
NetC113_2: C113.2 C137.2 FB4.1 R143.1 U35.4(VDD)
NetC117_2: C117.2 C123.2 FB14.1 R175.1 U36.4(VDD)
NetC118_2: C118.2 R16.2 U11.2(A)
NetC119_2: C119.2 R103.2 U16.2(A)
NetC120_2: C120.2 R107.2 U15.2(B)
NetC121_2: C121.2 R95.2 R253.1 U15.1(A) U16.1(OE)
NetC124_2: C124.2 Q22.3(D)
NetC125_2: C125.2 Q34.3(D)
NetC129_2: C129.2 U14.4(BYPASS)
NetC159_2: C159.2 R215.1 U26.5(VOUT_SENSE) U26.6(VOUT_FORCE)
NetC168_1: C168.1 R211.2 R212.1 U24.4(VIN-)
NetC168_2: C168.2 R214.2 U24.1(VOUT)
NetC170_2: C170.2 R215.2 U24.3(VIN+)
NetC173_1: C173.1 D42.1(K) Q2.1(B) Q6.3(E) U34.2(VSS)
NetC173_2: C173.2 FB5.1 R216.2 U34.5(VDD) U37.1(CATHODE)
NetC177_1: C177.1 R258.2
NetC177_2: C177.2 U40.2(VCC)
NetC178_1: C178.1 R247.2
NetC179_2: C179.2 C180.2 C181.2 C182.2 D35.2(K) FB7.1 R198.2
NetC183_1: C183.1 R251.2
NetC183_2: C183.2 C185.2 U40.8(COMP)
NetC184_2: C184.2 U40.10(SS)
NetC186_1: C186.1 R257.2
NetD5_1: D5.1(A) D5.2(K) R205.2 U34.4(VIN-)
NetD5_3: D5.3(K/A) Q1.3(C) R213.2 U34.3(VIN+)
NetD11_1: D11.1(K) IC1.23(PA13) R112.1
NetD12_1: D12.1(K) IC1.24(PA14) R111.1
NetD25_1: D25.1(C) D26.K Q4.1(G) Q9.2(D) Q9.4(D) R24.1
NetD27_1: D27.1(C) D28.K Q5.1(G) Q11.2(D) Q11.4(D) R30.1
NetD33_1: D33.1(K) Q32.3(D) R143.2 R229.1
NetD33_2: D33.2(A) Q22.1(G) R229.2 TP52.1
NetD34_1: D34.1(K) Q35.3(D) R175.2 R235.1
NetD34_2: D34.2(A) Q34.1(G) R235.2 TP54.1
NetD35_1: D35.1(A) L7.2 U40.12(SW_1) U40.13(SW_2) U40.14(SW_3)
NetD41_1: D41.1(K) R171.1 R177.2
NetD42_2: D42.2(A) Q6.1(B) R238.1 R239.1 U37.3(ANODE)
NetLED3_1: LED3.1(K) R116.2
NetQ1_1: Q1.1(B) R206.2
NetQ1_2: Q1.2(E) Q2.3(E)
NetQ2_2: Q2.2(C) Q2.4(C) R241.2 R243.1
NetQ8_1: Q8.1(E) Q8.4(E) R66.2 R71.1 R74.1
NetQ8_2: Q8.2(B) R41.1 R66.1
NetQ8_5: Q8.5(B) R74.2 R78.1
NetQ9_1: Q9.1(G) R71.2 R76.1 TP46.1
NetQ10_1: Q10.1(E) Q10.4(E) R70.2 R85.1 R87.1
NetQ10_2: Q10.2(B) R69.1 R70.1
NetQ10_5: Q10.5(B) R87.2 R224.1
NetQ11_1: Q11.1(G) R85.2 R223.1 TP47.1
NetQ12_1: Q12.1(G) R81.2 R86.2
NetQ12_3: Q12.3(D) R41.2 R67.2 R78.2
NetQ18_1: Q18.1(G) R225.2 R226.2
NetQ18_3: Q18.3(D) R69.2 R79.2 R224.2
NetQ19_1: Q19.1(G) R119.2 R193.2
NetQ19_3: Q19.3(D) R116.1
NetQ20_1: Q20.1(G) R227.2 R230.2 TP51.1
NetQ20_3: Q20.3(D) R174.1
NetQ32_1: Q32.1(G) R228.2 R231.2
NetQ33_1: Q33.1(G) R233.2 R236.2 TP53.1
NetQ33_3: Q33.3(D) R176.1
NetQ35_1: Q35.1(G) R234.2 R237.2
NetR16_1: R16.1 R228.1 U10.4(Y)
NetR18_1: R18.1 U11.4(Y)
NetR18_2: R18.2 U35.3(IN+)
NetR19_2: R19.2 U3.3(SHUTDOWN)
NetR31_2: R31.2 R34.1 U6.1(REF)
NetR35_2: R35.2 R36.1 U7.1(REF)
NetR100_1: R100.1 U35.5(OUT_SRC)
NetR103_1: R103.1 R234.1 U15.4(Y)
NetR104_1: R104.1 U16.4(Y)
NetR104_2: R104.2 U36.3(IN+)
NetR105_2: R105.2 U35.1(IN-)
NetR106_1: R106.1 U35.6(OUT_SNK)
NetR127_2: R127.2 R128.2
NetR128_1: R128.1 R129.2
NetR129_1: R129.1 R131.2
NetR138_2: R138.2 U3.5(~{ERROR})
NetR140_1: R140.1 U36.5(OUT_SRC)
NetR141_2: R141.2 U36.1(IN-)
NetR142_1: R142.1 U36.6(OUT_SNK)
NetR161_2: R161.2 R168.2
NetR168_1: R168.1 R169.2
NetR169_1: R169.1 R170.2
NetR198_1: R198.1 R248.2 U40.9(FB)
NetR203_1: R203.1 U23.7(OSC)
NetR206_1: R206.1 U34.1(VOUT)
NetR216_1: R216.1 R238.2 U37.2(REF)
NetR222_1: R222.1 R232.2 U18.2(FB/SENSE)
NetR239_2: R239.2 R240.1
NetR240_2: R240.2 R242.1
NetR249_2: R249.2 U40.11(MODE)
NetR250_2: R250.2 U40.5(RT)

Not connected (* = marked no-connect by the designer): U3 2(SENSE) 6(VTAP); U18 5(NC); U23 1(SD)

## Layout directives
net class HV_CURRENT_SENSE: (no net found under the mark)

## Notes on the sheet
- D35 - > 1 board B5819W
- (near D35) D35 - > 2 board SS2040HE
- ODWROTNA LOGIKA
- sprawdzić 3 - 5 K
- (near R126) 100KHz
- (near C72) PRZENIESC PGOOD GDZIES INDZIEJ
- (near CONN_BOTT) 5 IN / 4 OUT
- (near CONN_BOTT) 2 IN / 1 OUT
- (near CONN_BOTT) 3 IN / 3 OUT
- (in symbol ONSC-PNP-B1C2E3C4-4) 2, 4